# Altium schematic sheet icmu150_n32_dp.SchDoc: MU150
size 190 x 127 mm; DocumentNumber: xxx; SheetNumber: 1; SheetTotal: 1; Scale: 1:1; DocumentType: Схема электрическая принципиальная; PageSetup: Record=PageOptions|CenterHorizontal=True|CenterVertical=True|PrintScale=0.95|XCorrection=1.00|YCorrection=1.00|PrintKind=1|BorderSize=5000000|LeftOffset=0|BottomOffset=0|Orientation=1|PaperLength=1000|PaperWidth=1000|Scale=100|PaperSource=7|PrintQuality=-4|MediaType=1|DitherType=10|PrintScaleMode=1|PaperKind=A4|PaperIndex=9
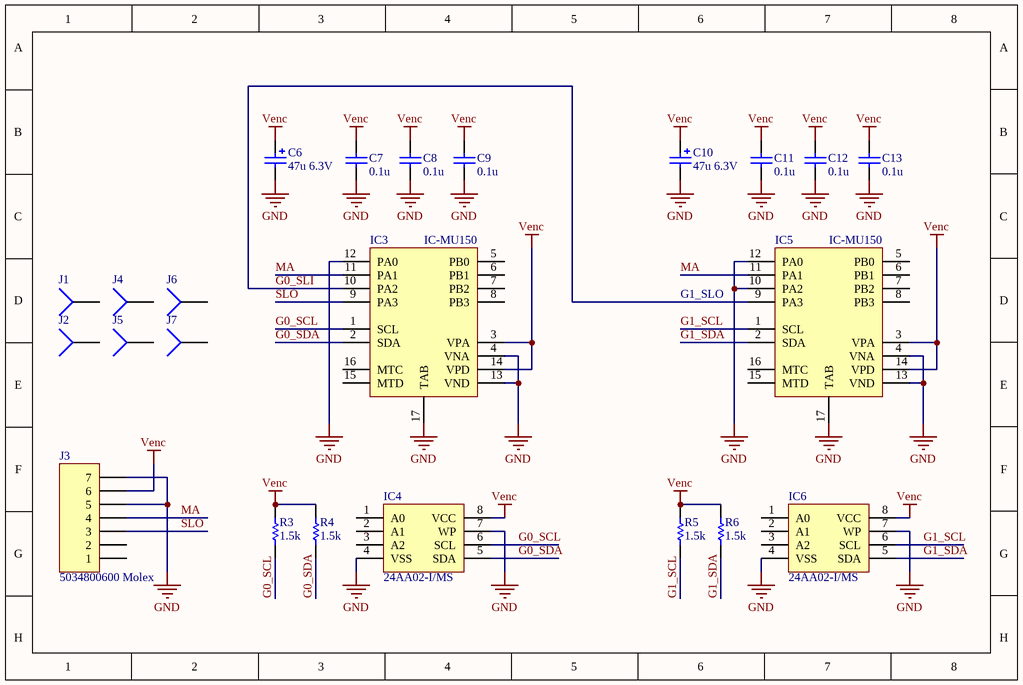
[diagram p0: icmu150_n32_dp.SchDoc]

## Parts
C6  47u 6.3V  [RC_0805_T0.8]
C7  0.1u  [RC_0402_T0.55]
C8  0.1u  [RC_0402_T0.55]
C9  0.1u  [RC_0402_T0.55]
C10  47u 6.3V  [RC_0805_T0.8]
C11  0.1u  [RC_0402_T0.55]
C12  0.1u  [RC_0402_T0.55]
C13  0.1u  [RC_0402_T0.55]
IC3  IC-MU150  [RR_DFN16]
IC4  24AA02-I/MS  [RR_MSOP8]
IC5  IC-MU150  [RR_DFN16]
IC6  24AA02-I/MS  [RR_MSOP8]
J1  Socket  [PIN]  (value not drawn)  (no BOM)
J2  Socket  [PIN]  (value not drawn)  (no BOM)
J3  5034800600 Molex  [RR_CONN_FPC_6_05_MOLEX wo pad]
J4  Socket  [PIN]  (value not drawn)  (no BOM)
J5  Socket  [PIN]  (value not drawn)  (no BOM)
J6  Socket  [PIN]  (value not drawn)  (no BOM)
J7  Socket  [PIN]  (value not drawn)  (no BOM)
R3  1.5k  [RR_0402]
R4  1.5k  [RR_0402]
R5  1.5k  [RR_0402]
R6  1.5k  [RR_0402]

## Nets
GND: C6.2 C7.2 C8.2 C9.2 C10.2 C11.2 C12.2 C13.2 IC3.4(VNA) IC3.12(PA0) IC3.13(VND) IC3.17(TAB) IC4.4(VSS) IC4.7(WP) IC5.4(VNA) IC5.10(PA2) IC5.12(PA0) IC5.13(VND) IC5.17(TAB) IC6.4(VSS) IC6.7(WP) J3.5 J3.7
Venc: C6.1 C7.1 C8.1 C9.1 C10.1 C11.1 C12.1 C13.1 IC3.3(VPA) IC3.14(VPD) IC4.8(VCC) IC5.3(VPA) IC5.14(VPD) IC6.8(VCC) J3.6 R3.1 R4.1 R5.1 R6.1
G0_SCL: IC3.1(SCL) IC4.6(SCL) R3.2
G0_SDA: IC3.2(SDA) IC4.5(SDA) R4.2
G0_SLI: IC3.10(PA2) IC5.9(PA3)
G1_SCL: IC5.1(SCL) IC6.6(SCL) R5.2
G1_SDA: IC5.2(SDA) IC6.5(SDA) R6.2
MA: IC3.11(PA1) IC5.11(PA1) J3.4
SLO: IC3.9(PA3) J3.3

Not connected (* = marked no-connect by the designer): IC3 5(PB0) 6(PB1) 7(PB2) 8(PB3) 15(MTD) 16(MTC); IC4 1(A0) 2(A1) 3(A2); IC5 5(PB0) 6(PB1) 7(PB2) 8(PB3) 15(MTD) 16(MTC); IC6 1(A0) 2(A1) 3(A2); J1 1; J2 1; J3 1 2; J4 1; J5 1; J6 1; J7 1

## Notes on the sheet
- G1_SLO
- Title
- Size:
- Date:
- A4
- Number:
- Time:
- Revision:
- Sheet
- of
- File:

## Library data of the parts
C6 C10 = Cap Pol2: Polarized Capacitor (Axial); Manufacturer: Yageo; Value: CAP TANT POLY 47UF 6.3V SMD; Order Number: T58W9476M6R3C0150; Cost: 0,1; Package: 0805
C7-C9 C11-C13 = Cap: Capacitor; Manufacturer: Yageo; Value: CAP CER 0.1UF 16V X7R 0402; Order Number: CC0402KRX7R7BB104; Cost: 0,1; Package: 0402
IC3 IC5 = IC-MU150: Magnetic Encoder; Manufacturer: iC-Haus; Value: Magnetic Off-Axis Absolute Position Encoder - pole width 1.50 mm; Order Number: iC-MU150 DFN16-5x5; Package: DFN16-5x5; Cost: 15,0
IC4 IC6 = 24AA02-I/SM: Manufacturer: Microchip Technology; Value: IC EEPROM 2K I2C 400KHZ 8MSOP; Package: MSOP8; Order Number: 24AA02-I/MS; Cost: 0,27
J3 = Header 7: Header, 7-Pin; Value: CONN FFC FPC 6POS 0.50MM; Order Number: 5034800600; Cost: 0,74; Manufacturer: Molex; Package: Nonstandart
R3-R6 = Res1: Resistor; Manufacturer: Yageo; Value: RES SMD 1.5K OHM 1% 1/16W 0402; Order Number: RC0402FR-071K5L; Package: 0402; Cost: 0,1